# Altium schematic sheet Row(Alt) - Copy.SchDoc
size A
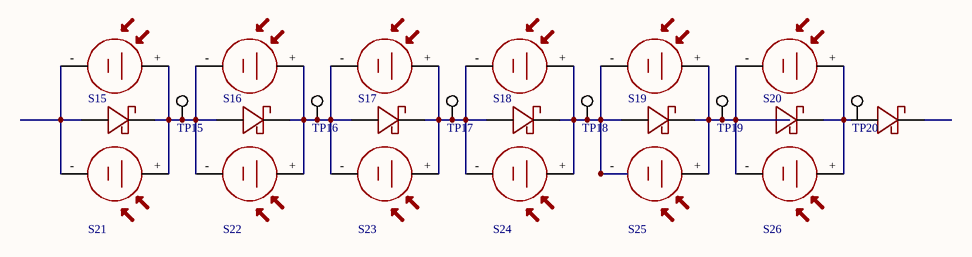
[diagram p0: Row(Alt) - Copy.SchDoc]

## Parts
D17  SCHOTTKY_DIODE_B120-FDICT-NDSCHOTTKY_DIODE_B120-FDICT-ND  [SB_DIODE]  (value not drawn)
D18  SCHOTTKY_DIODE_B120-FDICT-NDSCHOTTKY_DIODE_B120-FDICT-ND  [SB_DIODE]  (value not drawn)
D19  SCHOTTKY_DIODE_B120-FDICT-NDSCHOTTKY_DIODE_B120-FDICT-ND  [SB_DIODE]  (value not drawn)
D20  SCHOTTKY_DIODE_B120-FDICT-NDSCHOTTKY_DIODE_B120-FDICT-ND  [SB_DIODE]  (value not drawn)
D21  SCHOTTKY_DIODE_B120-FDICT-NDSCHOTTKY_DIODE_B120-FDICT-ND  [SB_DIODE]  (value not drawn)
D22  SCHOTTKY_DIODE_B120-FDICT-NDSCHOTTKY_DIODE_B120-FDICT-ND  [SB_DIODE]  (value not drawn)
D23  SCHOTTKY_DIODE_B120-FDICT-NDSCHOTTKY_DIODE_B120-FDICT-ND  [SB_DIODE]  (value not drawn)
S15  SOLAR_CELL  [SOLAR_CELL]  (value not drawn)
S16  SOLAR_CELL  [SOLAR_CELL]  (value not drawn)
S17  SOLAR_CELL  [SOLAR_CELL]  (value not drawn)
S18  SOLAR_CELL  [SOLAR_CELL]  (value not drawn)
S19  SOLAR_CELL  [SOLAR_CELL]  (value not drawn)
S20  SOLAR_CELL  [SOLAR_CELL]  (value not drawn)
S21  SOLAR_CELL  [SOLAR_CELL]  (value not drawn)
S22  SOLAR_CELL  [SOLAR_CELL]  (value not drawn)
S23  SOLAR_CELL  [SOLAR_CELL]  (value not drawn)
S24  SOLAR_CELL  [SOLAR_CELL]  (value not drawn)
S25  SOLAR_CELL  [SOLAR_CELL]  (value not drawn)
S26  SOLAR_CELL  [SOLAR_CELL]  (value not drawn)
TP15  TEST_POINT  [TEST_POINT]  (value not drawn)
TP16  TEST_POINT  [TEST_POINT]  (value not drawn)
TP17  TEST_POINT  [TEST_POINT]  (value not drawn)
TP18  TEST_POINT  [TEST_POINT]  (value not drawn)
TP19  TEST_POINT  [TEST_POINT]  (value not drawn)
TP20  TEST_POINT  [TEST_POINT]  (value not drawn)

## Nets
NetD17_NEG: D17.NEG D18.POS S15.+ S16.- S21.+ S22.- TP15.38
NetD17_POS: D17.POS S15.- S21.-
NetD18_NEG: D18.NEG D19.POS S16.+ S17.- S22.+ S23.- TP16.38
NetD19_NEG: D19.NEG D20.POS S17.+ S18.- S23.+ S24.- TP17.38
NetD20_NEG: D20.NEG D21.POS S18.+ S19.- S24.+ S25.- TP18.38
NetD21_NEG: D21.NEG S19.+ S20.- S25.+ S26.- TP19.38
NetD22_NEG: D22.NEG D23.POS S20.+ S26.+

Not connected (* = marked no-connect by the designer): D23 NEG; TP20 38

## Library data of the parts
D17-D23 = SCHOTTKY_DIODE_B120-FDICT-NDSCHOTTKY_DIODE_B120-FDICT-ND: GateName_1: G$1; SymbolName_1: SCHOTTKY_DIODE_B120-FDICT-ND; DeviceName: SCHOTTKY_DIODE_B120-FDICT-ND; LibraryName: Solar_Fadi; DeviceSetName: SCHOTTKY_DIODE_B120-FDICT-ND; Package: SCHOTTKY_DIODE_B120-FDICT-ND
TP15-TP20 = TEST_POINT: pin to pad: 38>PAD